# EAGLE design BORD3 (EAGLE 8.2.1)
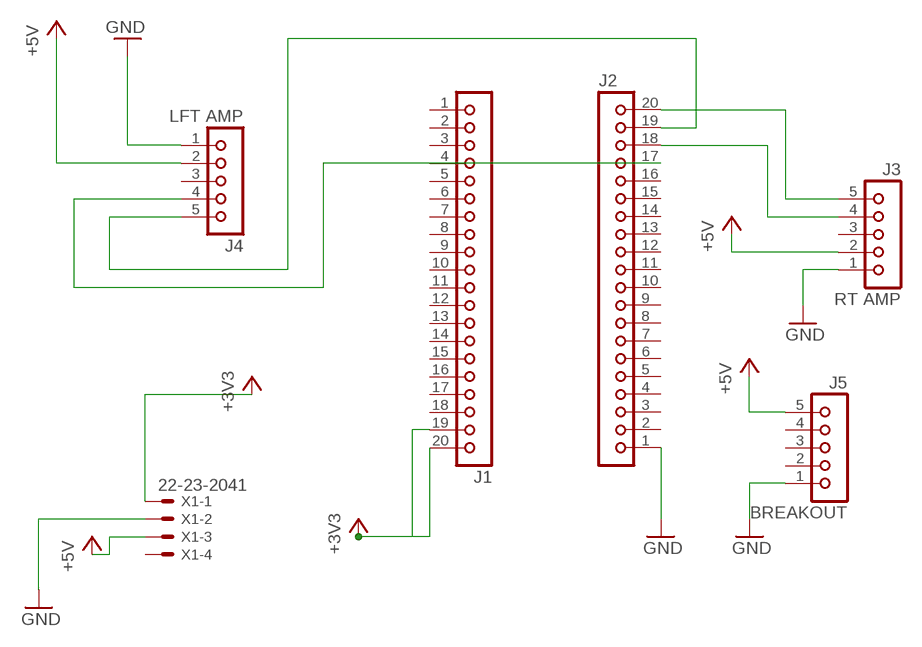
[diagram p0: schematic, sheet 1]

## Parts
J1  JBK20  [JBK20]
J2  JBK20  [JBK20]
J3  RT AMP  JU05  [JU05]
J4  LFT AMP  JU05  [JU05]
J5  BREAKOUT  JU05  [JU05]
X1  22-23-2041  [22-23-2041]

## Nets
+3V3: J1.19 J1.20 X1.1
+5V: J3.2 J4.2 J5.5 X1.3
GND: J2.1 J3.1 J4.1 J5.1 X1.2
N$3: J2.19 J4.5
N$4: J2.20 J3.5
N$5: J2.17 J4.4
N$6: J2.18 J3.4
Unconnected: J1.1 J1.2 J1.3 J1.4 J1.5 J1.6 J1.7 J1.8 J1.9 J1.10 J1.11 J1.12 J1.13 J1.14 J1.15 J1.16 J1.17 J1.18 J2.2 J2.3 J2.4 J2.5 J2.6 J2.7 J2.8 J2.9 J2.10 J2.11 J2.12 J2.13 J2.14 J2.15 J2.16 J3.3 J4.3 J5.2 J5.3 J5.4 X1.4

## Library data of the parts
J1 J2 = con-lsta:JBK20: PIN HEADER; OC_FARNELL: unknown; OC_NEWARK: unknown
J3-J5 = con-lsta:JU05: PIN HEADER; OC_FARNELL: unknown; OC_NEWARK: unknown
X1 = con-molex:22-23-2041: .100" (2.54mm) Center Header - 4 Pin; MF: MOLEX; MPN: 22-23-2041; OC_FARNELL: 1462920; OC_NEWARK: 38C0355

## Net classes
0 default: width 0.483 mm, drill 0.483 mm, clearance 0.483 mm

## Board
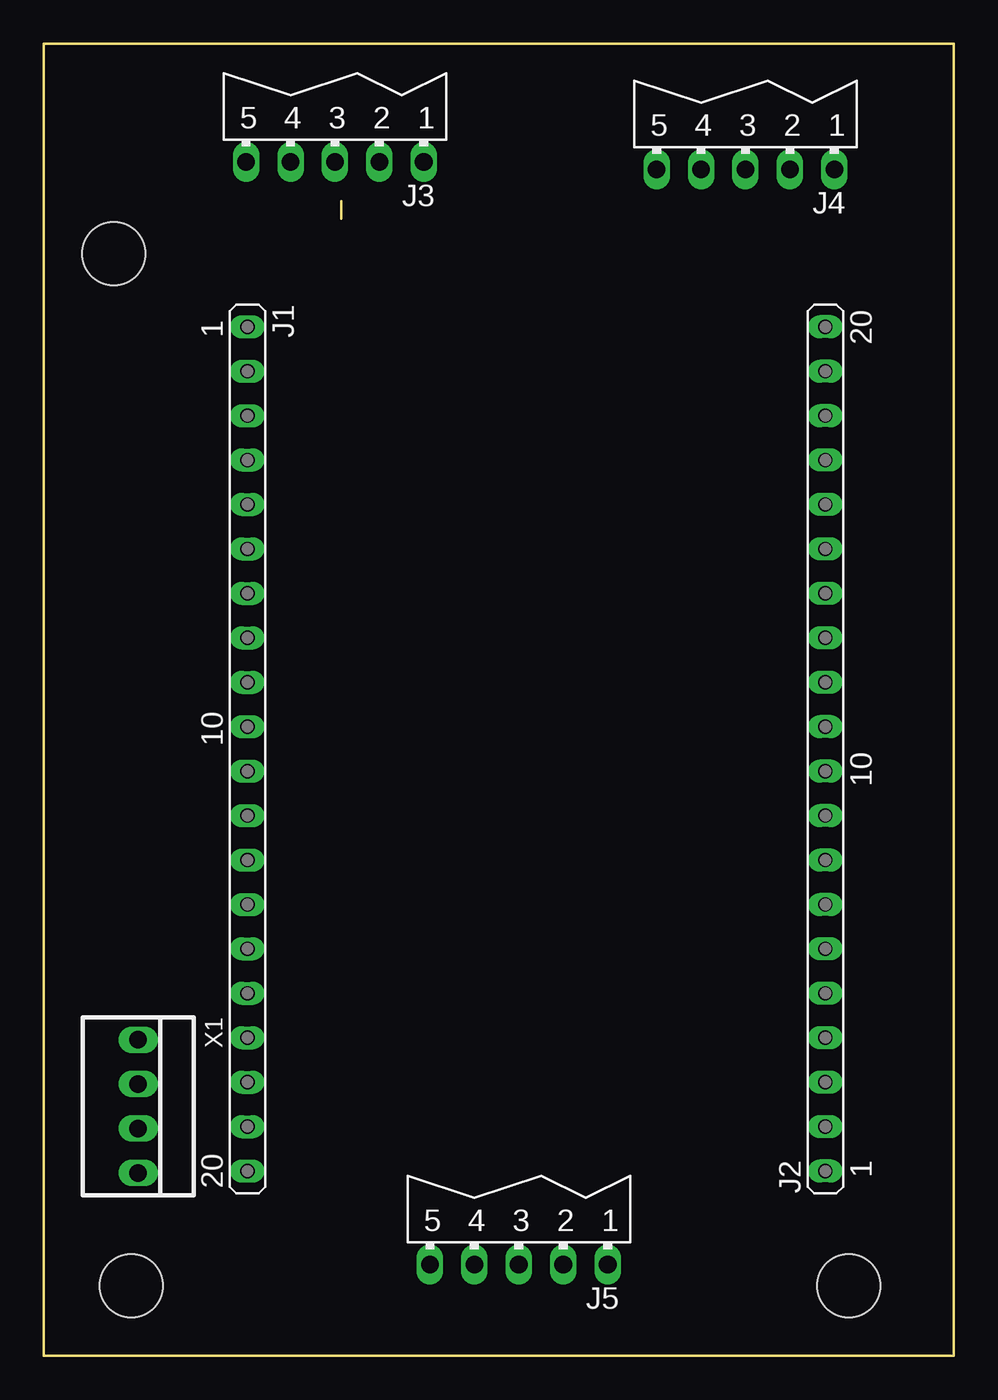
[diagram p1: board, top side]
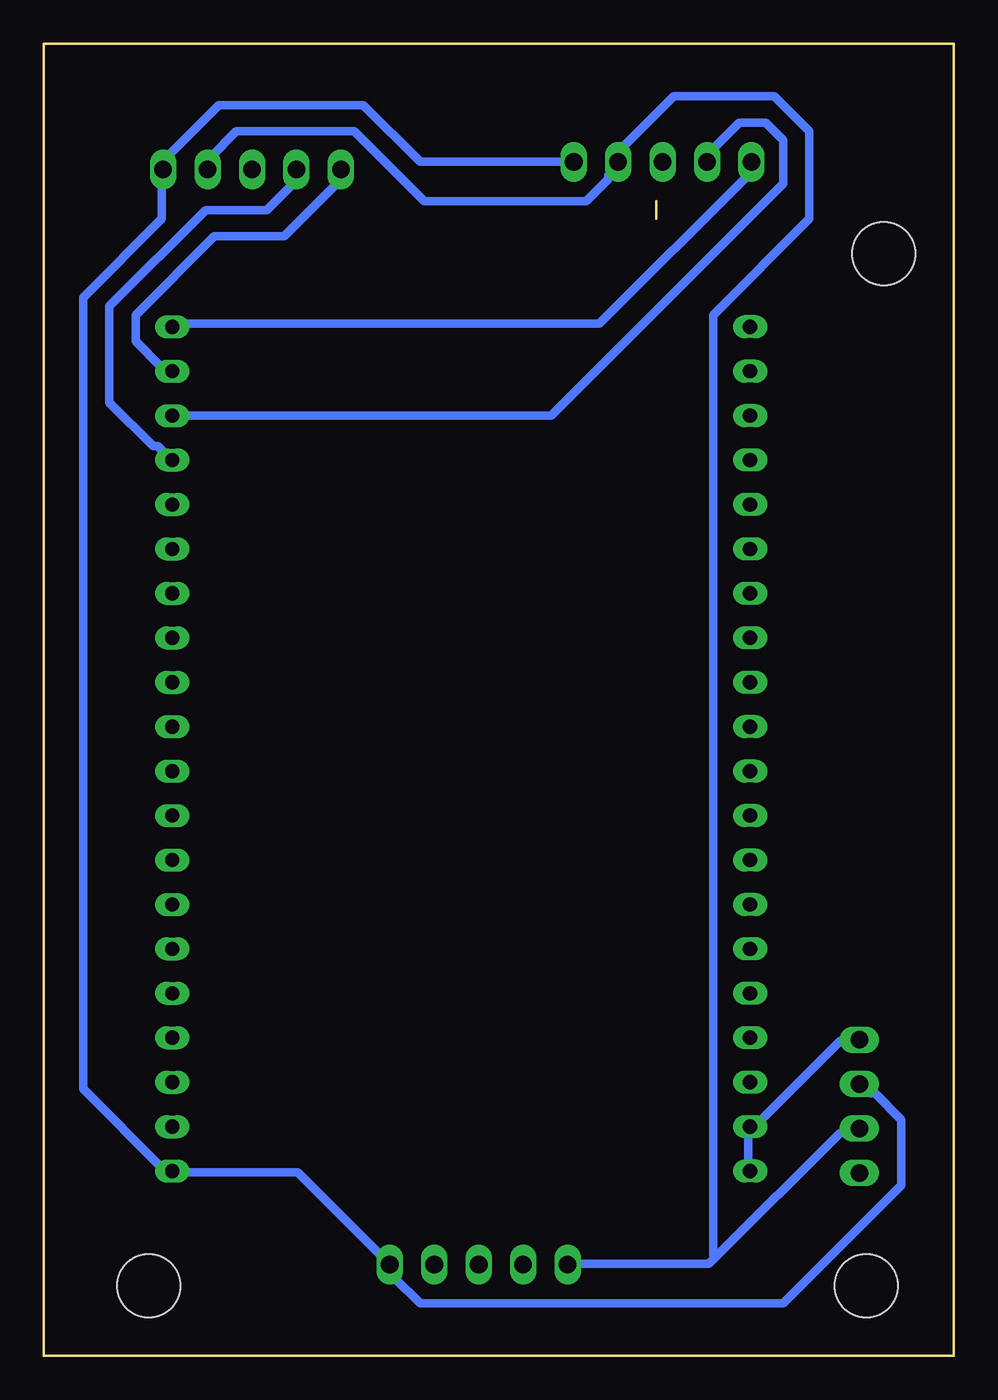
[diagram p2: board, bottom side, seen from below]

Size 52 x 75 mm. Coordinates in mm from the lower left corner, seen from the top.
Outline: 17,66 17,65
Outline: 52,0 0,0 0,75 52,75 52,0
Copper layers (1*16): Top 0.035mm / dielectric 1.5mm / Bottom 0.035mm
Design rules "OthermillDRC_1_32_v2": minimum track width 8mil, minimum drill 0.8mm, track to track 0.794003125mm, track to pad 0.794003125mm, pad to pad 0.794003125mm, via to via 0.794003125mm, smd to smd 0mil, copper to edge 0mil, drill to drill 1mil, minimum pad ring 10mil, minimum via ring 10mil, stop-mask expansion 1mil, vias tented up to drill 30mil, thermal gap 10mil
Holes 3.63 mm at 5,4 46,4 4,63

### Footprints (pad centres in the part's own frame; a part is rotated, then mirrored left to right if it is on the bottom)
JBK20 = drill 0.813 long: 1 -24.13,0; 2 -21.59,0; 3 -19.05,0; 4 -16.51,0; 5 -13.97,0; 6 -11.43,0; 7 -8.89,0; 8 -6.35,0; 9 -3.81,0; 10 -1.27,0; 11 1.27,0; 12 3.81,0; 13 6.35,0; 14 8.89,0; 15 11.43,0; 16 13.97,0; 17 16.51,0; 18 19.05,0; 19 21.59,0; 20 24.13,0
JU05 = drill 1.016 long: 1 -5.08,0; 2 -2.54,0; 3 0,0; 4 2.54,0; 5 5.08,0
22-23-2041 = drill 1 long: 1 -3.81,0; 2 -1.27,0; 3 1.27,0; 4 3.81,0

### Placement (x,y rotation side)
J1  11.64,34.69 270 top
J2  44.66,34.69 90 top
J3  16.64,68.24 180 top
J4  40.1,67.82 180 top
J5  27.15,5.21 180 top
X1  5.4,14.26 270 top

### Tracks (layer width: path | path; a pad name or v marks a point on that pad's centre or on a via)
+3V3
  Bottom 0.483: J1.20 11.75,10.75 11.75,13 J1.19 11.5,13 6.5,18 5.5,18 X1.1
+5V
  Bottom 0.483: J4.2 42.5,68 42.5,68.5 41,70 34.25,70 30.25,66 21,66 19.75,67.25 19.75,67.5 19.25,68 J3.2 19,68.25 19,69 16,72 10.25,72 8.25,70 8.25,65 13.75,59.5 13.75,5.75 13.62,5.62 | 13.62,5.62 14,5.25 22,5.25 J5.5 | 13.62,5.62 6.5,12.75 5.5,12.75 X1.3
GND
  Bottom 0.483: J3.1 21.75,68.25 30.5,68.25 33.75,71.5 42,71.5 45,68.5 45,68 J4.1 45.25,67.75 45.25,65 49.75,60.5 49.75,15.25 45.25,10.75 44.75,10.75 J2.1 44.5,10.5 37.5,10.5 32.25,5.25 J5.1 32,5 32,4.5 30.5,3 9.75,3 3,9.75 3,13.5 4.5,15 4.75,15 5.25,15.5 X1.2
N$3
  Bottom 0.483: J2.19 44.75,56.5 45.25,56.5 46.75,58 46.75,59.5 42.25,64 38.25,64 35.25,67 35.25,67.75 J4.5
N$4
  Bottom 0.483: J2.20 44.5,59 20.25,59 11.75,67.5 11.75,68 J3.5
N$5
  Bottom 0.483: J2.17 44.75,51.25 45.5,52 45.75,52 48.25,54.5 48.25,60 42.75,65.5 39.25,65.5 37.75,67 37.75,67.75 J4.4
N$6
  Bottom 0.483: J2.18 44.5,53.75 23,53.75 9.75,67 9.75,69.5 10.75,70.5 12.25,70.5 14,68.75 14,68.25 J3.4